# Altium project Dust1_MotherBoard_STM32WBA5MMG.PrjPcb
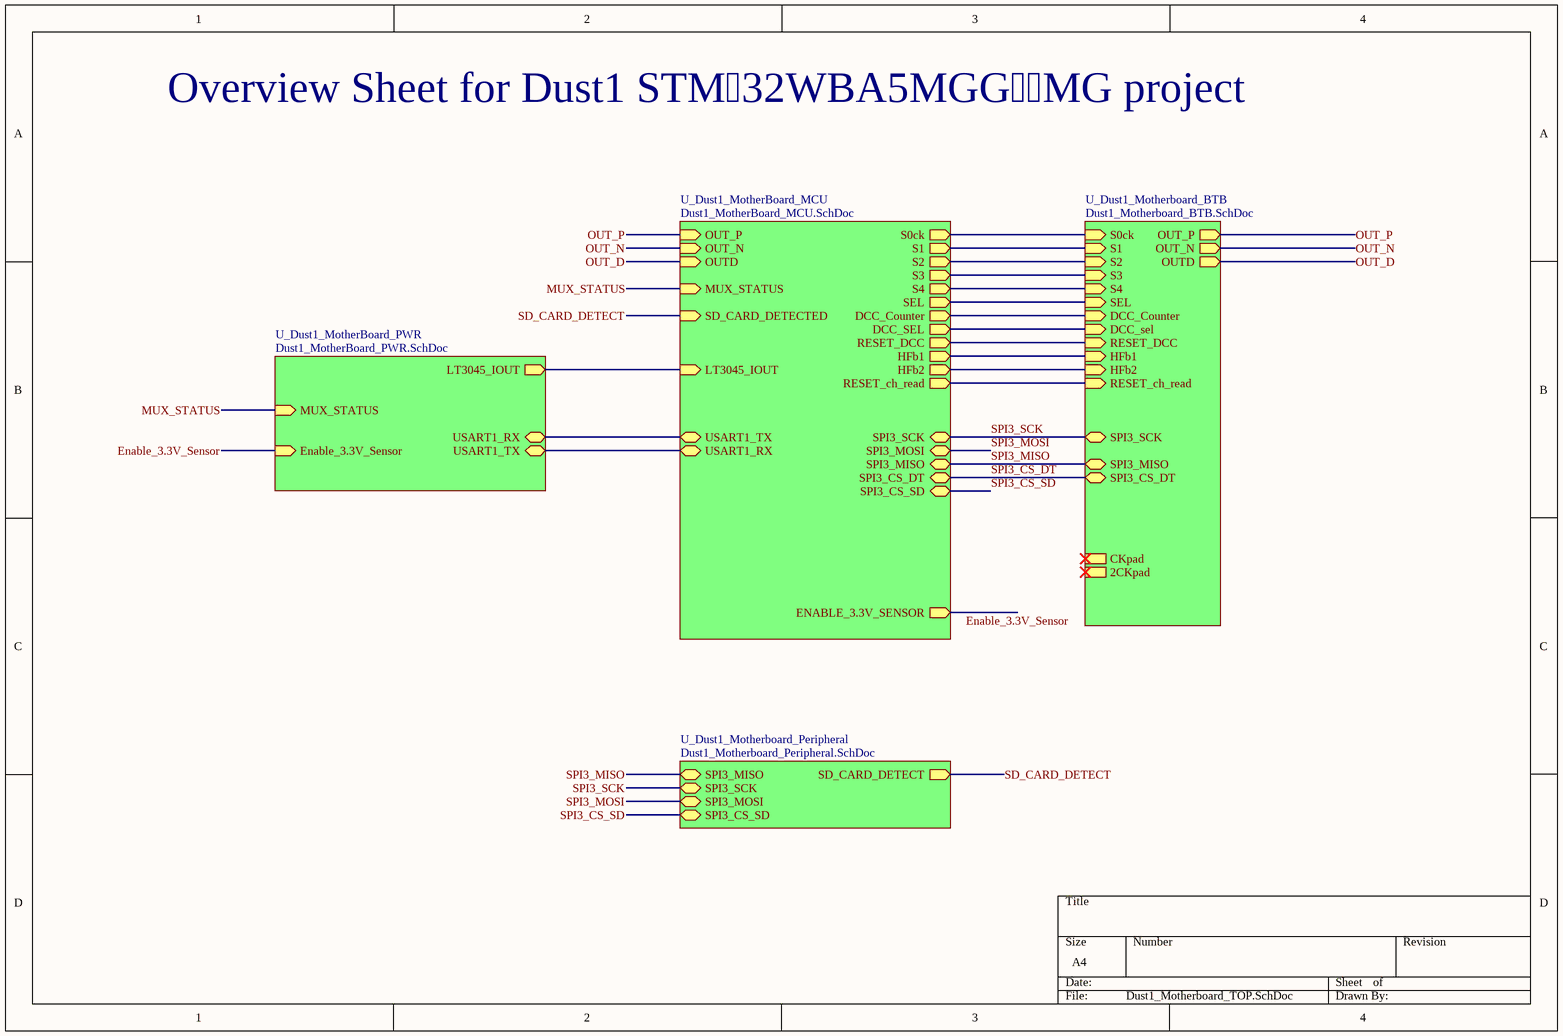
[diagram p0: Dust1_Motherboard_TOP.SchDoc]
5 sheets, 68 parts. Net scope: hierarchical (ports join the sheet entries above them; power ports are global).
Board file: Dust1_Motherboard_STM32WBA5MMG.PcbDoc
Sheets:
  Dust1_Motherboard_TOP.SchDoc
    U_Dust1_Motherboard_BTB = Dust1_Motherboard_BTB.SchDoc
    U_Dust1_MotherBoard_MCU = Dust1_MotherBoard_MCU.SchDoc
    U_Dust1_Motherboard_Peripheral = Dust1_Motherboard_Peripheral.SchDoc
    U_Dust1_MotherBoard_PWR = Dust1_MotherBoard_PWR.SchDoc

## Sheet Dust1_Motherboard_TOP.SchDoc
size A4; SheetNumber: 1; SheetTotal: 5

### Sub-sheets
U_Dust1_Motherboard_BTB = Dust1_Motherboard_BTB.SchDoc: OUT_P (out), OUT_N (out), DCC_Counter (in), OUTD (out), CKpad, 2CKpad, DCC_sel (in), RESET_DCC (in), S4 (in), S3 (in), S2 (in), S1 (in), SEL (in), SPI3_SCK (bidir), SPI3_MISO (bidir), SPI3_CS_DT (bidir), RESET_ch_read (in), HFb1 (in), HFb2 (in), S0ck (in)
U_Dust1_MotherBoard_MCU = Dust1_MotherBoard_MCU.SchDoc: SPI3_CS_DT (bidir), SPI3_MOSI (bidir), SPI3_MISO (bidir), SPI3_SCK (bidir), SPI3_CS_SD (bidir), USART1_TX (bidir), LT3045_IOUT (in), S0ck (out), S1 (out), S2 (out), S3 (out), S4 (out), SEL (out), DCC_Counter (out), DCC_SEL (out), OUTD (in), RESET_DCC (out), HFb1 (out), HFb2 (out), USART1_RX (bidir), ENABLE_3.3V_SENSOR (out), SD_CARD_DETECTED (in), RESET_ch_read (out), OUT_P (in), OUT_N (in), MUX_STATUS (in)
U_Dust1_Motherboard_Peripheral = Dust1_Motherboard_Peripheral.SchDoc: SPI3_MISO (bidir), SPI3_SCK (bidir), SPI3_MOSI (bidir), SPI3_CS_SD (bidir), SD_CARD_DETECT (out)
U_Dust1_MotherBoard_PWR = Dust1_MotherBoard_PWR.SchDoc: USART1_RX (bidir), USART1_TX (bidir), MUX_STATUS (in), Enable_3.3V_Sensor (in), LT3045_IOUT (out)

### Nets
DCC_Counter: sheet U_Dust1_Motherboard_BTB/DCC_Counter, sheet U_Dust1_MotherBoard_MCU/DCC_Counter
DCC_SEL: sheet U_Dust1_Motherboard_BTB/DCC_sel, sheet U_Dust1_MotherBoard_MCU/DCC_SEL
Enable_3.3V_Sensor: sheet U_Dust1_MotherBoard_MCU/ENABLE_3.3V_SENSOR, sheet U_Dust1_MotherBoard_PWR/Enable_3.3V_Sensor
HFb1: sheet U_Dust1_Motherboard_BTB/HFb1, sheet U_Dust1_MotherBoard_MCU/HFb1
HFb2: sheet U_Dust1_Motherboard_BTB/HFb2, sheet U_Dust1_MotherBoard_MCU/HFb2
LT3045_IOUT: sheet U_Dust1_MotherBoard_MCU/LT3045_IOUT, sheet U_Dust1_MotherBoard_PWR/LT3045_IOUT
MUX_STATUS: sheet U_Dust1_MotherBoard_MCU/MUX_STATUS, sheet U_Dust1_MotherBoard_PWR/MUX_STATUS
OUT_D: sheet U_Dust1_Motherboard_BTB/OUTD, sheet U_Dust1_MotherBoard_MCU/OUTD
OUT_N: sheet U_Dust1_Motherboard_BTB/OUT_N, sheet U_Dust1_MotherBoard_MCU/OUT_N
OUT_P: sheet U_Dust1_Motherboard_BTB/OUT_P, sheet U_Dust1_MotherBoard_MCU/OUT_P
RESET_ch_read: sheet U_Dust1_Motherboard_BTB/RESET_ch_read, sheet U_Dust1_MotherBoard_MCU/RESET_ch_read
RESET_DCC: sheet U_Dust1_Motherboard_BTB/RESET_DCC, sheet U_Dust1_MotherBoard_MCU/RESET_DCC
S0ck: sheet U_Dust1_Motherboard_BTB/S0ck, sheet U_Dust1_MotherBoard_MCU/S0ck
S1: sheet U_Dust1_Motherboard_BTB/S1, sheet U_Dust1_MotherBoard_MCU/S1
S2: sheet U_Dust1_Motherboard_BTB/S2, sheet U_Dust1_MotherBoard_MCU/S2
S3: sheet U_Dust1_Motherboard_BTB/S3, sheet U_Dust1_MotherBoard_MCU/S3
S4: sheet U_Dust1_Motherboard_BTB/S4, sheet U_Dust1_MotherBoard_MCU/S4
SD_CARD_DETECT: sheet U_Dust1_MotherBoard_MCU/SD_CARD_DETECTED, sheet U_Dust1_Motherboard_Peripheral/SD_CARD_DETECT
SEL: sheet U_Dust1_Motherboard_BTB/SEL, sheet U_Dust1_MotherBoard_MCU/SEL
SPI3_CS_DT: sheet U_Dust1_Motherboard_BTB/SPI3_CS_DT, sheet U_Dust1_MotherBoard_MCU/SPI3_CS_DT
SPI3_CS_SD: sheet U_Dust1_MotherBoard_MCU/SPI3_CS_SD, sheet U_Dust1_Motherboard_Peripheral/SPI3_CS_SD
SPI3_MISO: sheet U_Dust1_Motherboard_BTB/SPI3_MISO, sheet U_Dust1_MotherBoard_MCU/SPI3_MISO, sheet U_Dust1_Motherboard_Peripheral/SPI3_MISO
SPI3_MOSI: sheet U_Dust1_MotherBoard_MCU/SPI3_MOSI, sheet U_Dust1_Motherboard_Peripheral/SPI3_MOSI
SPI3_SCK: sheet U_Dust1_Motherboard_BTB/SPI3_SCK, sheet U_Dust1_MotherBoard_MCU/SPI3_SCK, sheet U_Dust1_Motherboard_Peripheral/SPI3_SCK
NetU4_17: sheet U_Dust1_MotherBoard_MCU/USART1_TX, sheet U_Dust1_MotherBoard_PWR/USART1_RX
NetU4_18: sheet U_Dust1_MotherBoard_MCU/USART1_RX, sheet U_Dust1_MotherBoard_PWR/USART1_TX

### Notes on the sheet
- Overview Sheet for Dust1 STM32WBA5MGGMG project

## Sheet Dust1_Motherboard_BTB.SchDoc
size A4; SheetNumber: 4; SheetTotal: 5
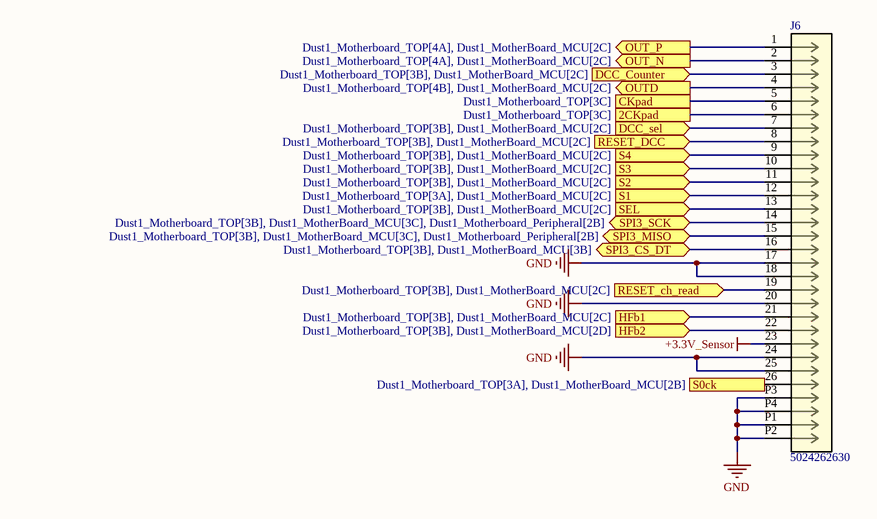
[diagram p1: Dust1_Motherboard_BTB.SchDoc]

### Parts
J6  5024262630  [CON_5024262630_MOL]

### Ports
2CKpad (see Dust1_Motherboard_TOP[3C]), CKpad (see Dust1_Motherboard_TOP[3C]), DCC_Counter (in, see Dust1_Motherboard_TOP[3B], Dust1_MotherBoard_MCU[2C]), DCC_sel (in, see Dust1_Motherboard_TOP[3B], Dust1_MotherBoard_MCU[2C]), HFb1 (in, see Dust1_Motherboard_TOP[3B], Dust1_MotherBoard_MCU[2C]), HFb2 (in, see Dust1_Motherboard_TOP[3B], Dust1_MotherBoard_MCU[2D]), OUT_N (out, see Dust1_Motherboard_TOP[4A], Dust1_MotherBoard_MCU[2C]), OUT_P (out, see Dust1_Motherboard_TOP[4A], Dust1_MotherBoard_MCU[2C]), OUTD (out, see Dust1_Motherboard_TOP[4B], Dust1_MotherBoard_MCU[2C]), RESET_ch_read (in, see Dust1_Motherboard_TOP[3B], Dust1_MotherBoard_MCU[2C]), RESET_DCC (in, see Dust1_Motherboard_TOP[3B], Dust1_MotherBoard_MCU[2C]), S0ck (in, see Dust1_Motherboard_TOP[3A], Dust1_MotherBoard_MCU[2B]), S1 (in, see Dust1_Motherboard_TOP[3A], Dust1_MotherBoard_MCU[2C]), S2 (in, see Dust1_Motherboard_TOP[3B], Dust1_MotherBoard_MCU[2C]), S3 (in, see Dust1_Motherboard_TOP[3B], Dust1_MotherBoard_MCU[2C]), S4 (in, see Dust1_Motherboard_TOP[3B], Dust1_MotherBoard_MCU[2C]), SEL (in, see Dust1_Motherboard_TOP[3B], Dust1_MotherBoard_MCU[2C]), SPI3_CS_DT (bidir, see Dust1_Motherboard_TOP[3B], Dust1_MotherBoard_MCU[3B]), SPI3_MISO (bidir, see Dust1_Motherboard_TOP[3B], Dust1_MotherBoard_MCU[3C], Dust1_Motherboard_Peripheral[2B]), SPI3_SCK (bidir, see Dust1_Motherboard_TOP[3B], Dust1_MotherBoard_MCU[3C], Dust1_Motherboard_Peripheral[2B])

### Nets
+3.3V_Sensor: J6.23
GND: J6.17 J6.18 J6.20 J6.24 J6.25 J6.P1 J6.P2 J6.P3 J6.P4
DCC_Counter: J6.3 ; port DCC_Counter
DCC_SEL: J6.7 ; port DCC_sel
HFb1: J6.21 ; port HFb1
HFb2: J6.22 ; port HFb2
OUT_D: J6.4 ; port OUTD
OUT_N: J6.2 ; port OUT_N
OUT_P: J6.1 ; port OUT_P
RESET_ch_read: J6.19 ; port RESET_ch_read
RESET_DCC: J6.8 ; port RESET_DCC
S0ck: J6.26 ; port S0ck
S1: J6.12 ; port S1
S2: J6.11 ; port S2
S3: J6.10 ; port S3
S4: J6.9 ; port S4
SEL: J6.13 ; port SEL
SPI3_CS_DT: J6.16 ; port SPI3_CS_DT
SPI3_MISO: J6.15 ; port SPI3_MISO
SPI3_SCK: J6.14 ; port SPI3_SCK
NetJ6_5: J6.5 ; port CKpad
NetJ6_6: J6.6 ; port 2CKpad

### Library data of the parts
J6 = CMP-125-000000-4: SlimStack Board-to-Board Receptacle, 0.40mm Pitch, Surface Mount, Dual Row, Vertical, 1.00mm Stacking Height, with Solder Tabs, with Vacuum Tape, 26 Circuits; Manufacturer_Name: Molex Connector Corporation; RefDes: RefDes; Copyright: Copyright (C) 2025 Ultra Librarian. All rights reserved.; Manufacturer_Part_Number: 5024262630; Design Item ID: 5024262630; Source: 5024262630.SchLib; Type: Type

## Sheet Dust1_MotherBoard_MCU.SchDoc
size A4; SheetNumber: 2; SheetTotal: 5
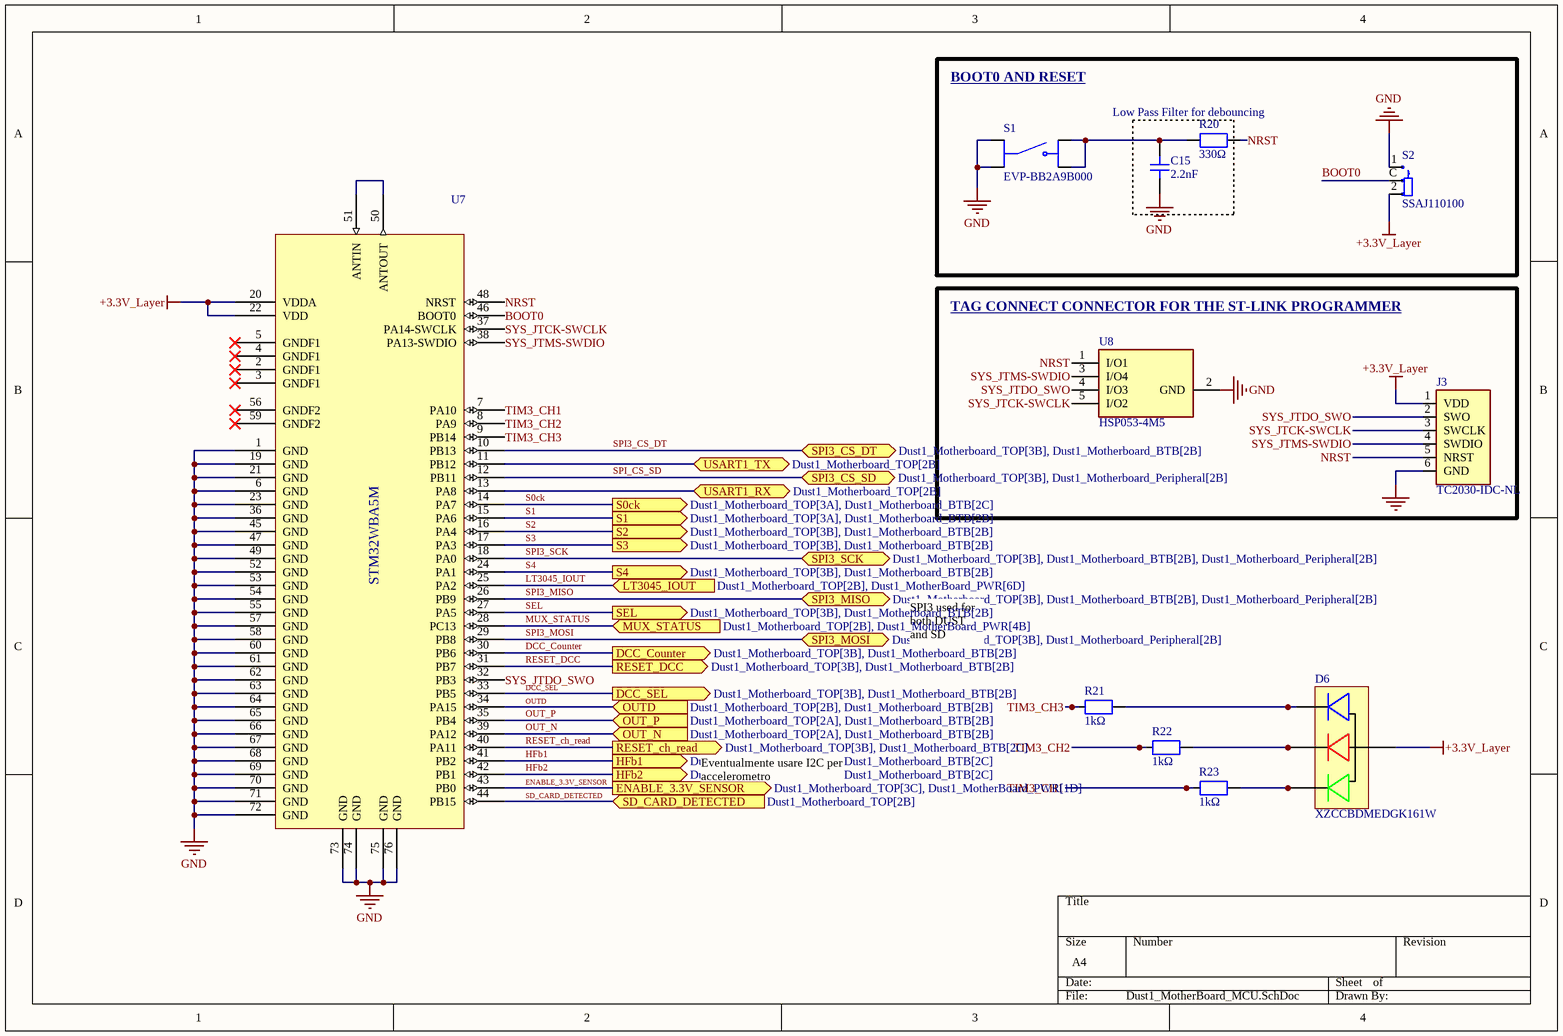
[diagram p2: Dust1_MotherBoard_MCU.SchDoc]

### Parts
C15  2.2nF  [CAP_0402]
D6  XZCCBDMEDGK161W  [PCBComponent_1]
J3  TC2030-IDC-NL  [TAG_TC2030-IDC-NL]
R20  330Ω  [RES_0402]
R21  1kΩ  [RES_0402]
R22  1kΩ  [RES_0402]
R23  1kΩ  [RES_0402]
S1  EVP-BB2A9B000  [SW_EVP-BB2A9B000]
S2  SSAJ110100  [SW_SSAJ110100]
U7  STM32WBA5MMG  [LGA76_stm32wba5mmg_C50P9X9_800X1250X137]  (value not drawn)
U8  HSP053-4M5  [HSP0534M5]

### Blocks framed on the sheet
BOOT0 AND RESET: C15 R20 S1 S2
TAG CONNECT CONNECTOR FOR THE ST-LINK PROGRAMMER: J3 U8

### Ports
DCC_Counter (out, see Dust1_Motherboard_TOP[3B], Dust1_Motherboard_BTB[2B]), DCC_SEL (out, see Dust1_Motherboard_TOP[3B], Dust1_Motherboard_BTB[2B]), ENABLE_3.3V_SENSOR (out, see Dust1_Motherboard_TOP[3C], Dust1_MotherBoard_PWR[1D]), HFb1 (out, see Dust1_Motherboard_TOP[3B], Dust1_Motherboard_BTB[2C]), HFb2 (out, see Dust1_Motherboard_TOP[3B], Dust1_Motherboard_BTB[2C]), LT3045_IOUT (in, see Dust1_Motherboard_TOP[2B], Dust1_MotherBoard_PWR[6D]), MUX_STATUS (in, see Dust1_Motherboard_TOP[2B], Dust1_MotherBoard_PWR[4B]), OUT_N (in, see Dust1_Motherboard_TOP[2A], Dust1_Motherboard_BTB[2B]), OUT_P (in, see Dust1_Motherboard_TOP[2A], Dust1_Motherboard_BTB[2B]), OUTD (in, see Dust1_Motherboard_TOP[2B], Dust1_Motherboard_BTB[2B]), RESET_ch_read (out, see Dust1_Motherboard_TOP[3B], Dust1_Motherboard_BTB[2C]), RESET_DCC (out, see Dust1_Motherboard_TOP[3B], Dust1_Motherboard_BTB[2B]), S0ck (out, see Dust1_Motherboard_TOP[3A], Dust1_Motherboard_BTB[2C]), S1 (out, see Dust1_Motherboard_TOP[3A], Dust1_Motherboard_BTB[2B]), S2 (out, see Dust1_Motherboard_TOP[3B], Dust1_Motherboard_BTB[2B]), S3 (out, see Dust1_Motherboard_TOP[3B], Dust1_Motherboard_BTB[2B]), S4 (out, see Dust1_Motherboard_TOP[3B], Dust1_Motherboard_BTB[2B]), SD_CARD_DETECTED (in, see Dust1_Motherboard_TOP[2B]), SEL (out, see Dust1_Motherboard_TOP[3B], Dust1_Motherboard_BTB[2B]), SPI3_CS_DT (bidir, see Dust1_Motherboard_TOP[3B], Dust1_Motherboard_BTB[2B]), SPI3_CS_SD (bidir, see Dust1_Motherboard_TOP[3B], Dust1_Motherboard_Peripheral[2B]), SPI3_MISO (bidir, see Dust1_Motherboard_TOP[3B], Dust1_Motherboard_BTB[2B], Dust1_Motherboard_Peripheral[2B]), SPI3_MOSI (bidir, see Dust1_Motherboard_TOP[3B], Dust1_Motherboard_Peripheral[2B]), SPI3_SCK (bidir, see Dust1_Motherboard_TOP[3B], Dust1_Motherboard_BTB[2B], Dust1_Motherboard_Peripheral[2B]), USART1_RX (bidir, see Dust1_Motherboard_TOP[2B]), USART1_TX (bidir, see Dust1_Motherboard_TOP[2B])

### Nets
+3.3V_Layer: D6.2 J3.1(VDD) S2.2 U7.20(VDDA) U7.22(VDD)
GND: C15.1 J3.6(GND) S1.A1 S1.A2 S2.1 U7.1(GND) U7.6(GND) U7.19(GND) U7.21(GND) U7.23(GND) U7.36(GND) U7.45(GND) U7.47(GND) U7.49(GND) U7.52(GND) U7.53(GND) U7.54(GND) U7.55(GND) U7.57(GND) U7.58(GND) U7.60(GND) U7.61(GND) U7.62(GND) U7.63(GND) U7.64(GND) U7.65(GND) U7.66(GND) U7.67(GND) U7.68(GND) U7.69(GND) U7.70(GND) U7.71(GND) U7.72(GND) U7.73(GND) U7.74(GND) U7.75(GND) U7.76(GND) U8.2(GND)
BOOT0: S2.C U7.46(BOOT0)
DCC_Counter: U7.30(PB6) ; port DCC_Counter
DCC_SEL: U7.33(PB5) ; port DCC_SEL
Enable_3.3V_Sensor: U7.43(PB0) ; port ENABLE_3.3V_SENSOR
HFb1: U7.41(PB2) ; port HFb1
HFb2: U7.42(PB1) ; port HFb2
LT3045_IOUT: U7.25(PA2) ; port LT3045_IOUT
MUX_STATUS: U7.28(PC13) ; port MUX_STATUS
NRST: J3.5(NRST) R20.2 U7.48(NRST) U8.1(I/O1)
OUT_N: U7.39(PA12) ; port OUT_N
OUT_P: U7.35(PB4) ; port OUT_P
OUTD: U7.34(PA15) ; port OUTD  [project net OUT_D]
RESET_ch_read: U7.40(PA11) ; port RESET_ch_read
RESET_DCC: U7.31(PB7) ; port RESET_DCC
S0ck: U7.14(PA7) ; port S0ck
S1: U7.15(PA6) ; port S1
S2: U7.16(PA4) ; port S2
S3: U7.17(PA3) ; port S3
S4: U7.24(PA1) ; port S4
SD_CARD_DETECTED: U7.44(PB15) ; port SD_CARD_DETECTED  [project net SD_CARD_DETECT]
SEL: U7.27(PA5) ; port SEL
SPI3_CS_DT: U7.10(PB13) ; port SPI3_CS_DT
SPI3_MISO: U7.26(PB9) ; port SPI3_MISO
SPI3_MOSI: U7.29(PB8) ; port SPI3_MOSI
SPI3_SCK: U7.18(PA0) ; port SPI3_SCK
SPI_CS_SD: U7.12(PB11) ; port SPI3_CS_SD  [project net SPI3_CS_SD]
SYS_JTCK-SWCLK: J3.3(SWCLK) U7.37(PA14-SWCLK) U8.5(I/O2)
SYS_JTDO_SWO: J3.2(SWO) U7.32(PB3) U8.4(I/O3)
SYS_JTMS-SWDIO: J3.4(SWDIO) U7.38(PA13-SWDIO) U8.3(I/O4)
TIM3_CH1: R23.1 U7.7(PA10)
TIM3_CH2: R22.1 U7.8(PA9)
TIM3_CH3: R21.1 U7.9(PB14)
NetC15_2: C15.2 R20.1 S1.B1 S1.B2
NetD6_1: D6.1 R21.2
NetD6_3: D6.3 R22.2
NetD6_4: D6.4 R23.2
NetU4_17: U7.11(PB12) ; port USART1_TX
NetU4_18: U7.13(PA8) ; port USART1_RX
NetU7_50: U7.50(ANTOUT) U7.51(ANTIN)

Not connected (* = marked no-connect by the designer): U7 2(GNDF1)* 3(GNDF1)* 4(GNDF1)* 5(GNDF1)* 56(GNDF2)* 59(GNDF2)*

### Notes on the sheet
- (near R20) Low Pass Filter for debouncing
- SPI3 used for both DUST and SD
- Eventualmente usare I2C per accelerometro
- (in symbol CMP-00014-5) STM32WBA5M

### Library data of the parts
C15 = CMP-001-00099-2: Generic 0402 Capacitor; Design Item ID: CAP_0402; Source: CAP_0402.SchLib
D6 = CMP-007-00036-1: Source: XZCCBDMEDGK161W.SchLib; Design Item ID: XZCCBDMEDGK161W
J3 = CMP-00019-5: CABLE ADAPTER 6 POS; Component Type: Standard; Design Item ID: TC2030-IDC-NL; Package: None; MP: TC2030-IDC-NL; Value: *; Pin Count: 6; Source: TC2030-IDC-NL.SchLib; Availability: Unavailable; Price: None
R20-R23 = CMP-009-00192-1: Resistor SMD 0402 Generic; Design Item ID: RES_0402; Source: RES_0402.SchLib
S1 = CMP-011-00022-2: Tactile Switch SPST-NO Top Actuated Surface Mount; MF: Panasonic Electronic Components; SnapEDA_Link: https://www.snapeda.com/parts/EVP-BB2A9B000/Panasonic+Electronic+Components/view-part/?ref=snap; Pins: 4; Value: *; Design Item ID: EVP-BB2A9B000; Check_prices: https://www.snapeda.com/parts/EVP-BB2A9B000/Panasonic+Electronic+Components/view-part/?ref=eda; Case/Package: None; MP: EVP-BB2A9B000; Component Type: Standard; Source: EVP-BB2A9B000.SchLib
S2 = CMP-011-00025-3: Slide Switch â€¢ Rating (max.): 10 mA 5 VDC â€¢ Poles: 1 â€¢ Positions: 2 â€¢ Travel : 1.4 mm â€¢ Operating direction: Horizontal; MF: ALPS; Source: SSAJ110100.SchLib; MP: SSAJ110100; Case/Package: None; Availability: In Stock; Value: *; Purchase-URL: https://pricing.snapeda.com/search/part/SSAJ110100/?ref=eda; Component Type: Standard; Design Item ID: SSAJ110100; Check_prices: https://www.snapeda.com/parts/SSAJ110100/ALPS/view-part/?ref=eda; Price: None; Pins: 3; SnapEDA_Link: https://www.snapeda.com/parts/SSAJ110100/ALPS/view-part/?ref=snap
U7 = CMP-00014-5: Bluetooth LE and IEEE 802.15.4 radio module
U8 = CMP-004-00039-6: Clamp Ipp Tvs Diode Surface Mount 5-uQFN (1.3x0.8); Manufacturer_Name: STMicroelectronics; Geometry.Height: 0.4mm; Source: HSP053-4M5.SchLib; Design Item ID: HSP053-4M5; Mouser Price/Stock: https://www.mouser.co.uk/ProductDetail/STMicroelectronics/HSP053-4M5?qs=lYGu3FyN48c0CphNYEE2iw%3D%3D; Mouser Part Number: 511-HSP053-4M5; Datasheet Link: https://www.st.com/resource/en/datasheet/hsp051-4m5.pdf; Manufacturer_Part_Number: HSP053-4M5

## Sheet Dust1_Motherboard_Peripheral.SchDoc
size A4; SheetNumber: 5; SheetTotal: 5
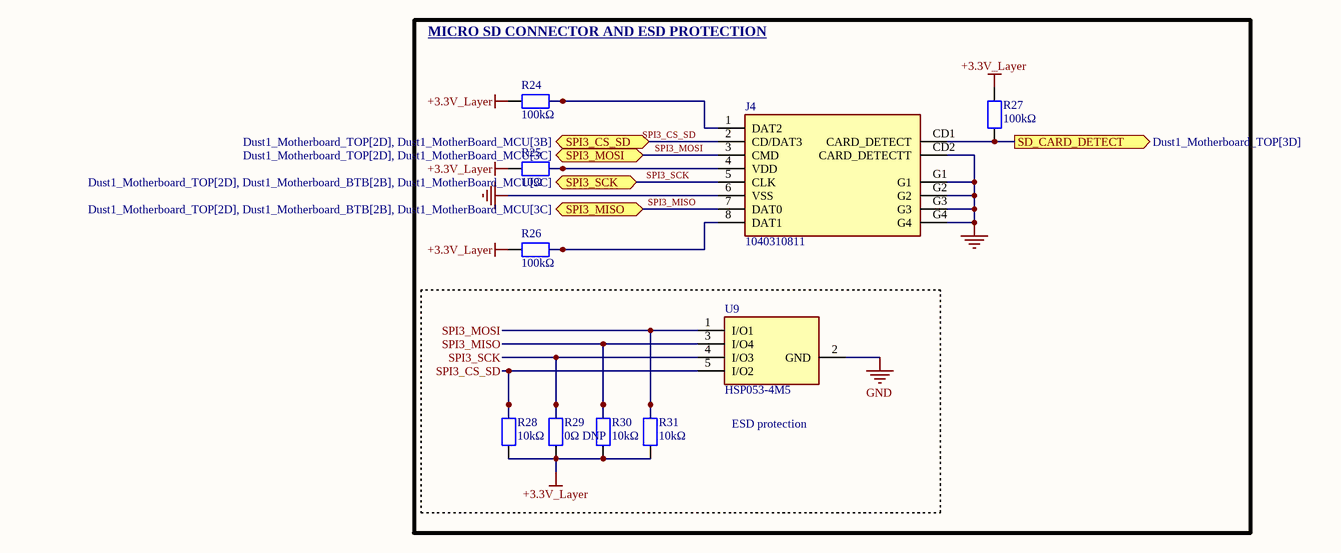
[diagram p3: Dust1_Motherboard_Peripheral.SchDoc]

### Parts
J4  1040310811  [1040310811]
R24  100kΩ  [RES_0402]
R25  10Ω  [RES_0402]
R26  100kΩ  [RES_0402]
R27  100kΩ  [RES_0402]
R28  10kΩ  [RES_0402]
R29  0Ω DNP  [RES_0402]
R30  10kΩ  [RES_0402]
R31  10kΩ  [RES_0402]
U9  HSP053-4M5  [HSP0534M5]

### Blocks framed on the sheet
MICRO SD CONNECTOR AND ESD PROTECTION: J4 R24-R27
ESD protection: R28-R31 U9

### Ports
SD_CARD_DETECT (out, see Dust1_Motherboard_TOP[3D]), SPI3_CS_SD (bidir, see Dust1_Motherboard_TOP[2D], Dust1_MotherBoard_MCU[3B]), SPI3_MISO (bidir, see Dust1_Motherboard_TOP[2D], Dust1_Motherboard_BTB[2B], Dust1_MotherBoard_MCU[3C]), SPI3_MOSI (bidir, see Dust1_Motherboard_TOP[2D], Dust1_MotherBoard_MCU[3C]), SPI3_SCK (bidir, see Dust1_Motherboard_TOP[2D], Dust1_Motherboard_BTB[2B], Dust1_MotherBoard_MCU[3C])

### Nets
+3.3V_Layer: R24.2 R25.2 R26.2 R27.2 R28.1 R29.1 R30.1 R31.1
GND: J4.6(VSS) J4.CD2(CARD_DETECTT) J4.G1 J4.G2 J4.G3 J4.G4 U9.2(GND)
SD_CARD_DETECT: J4.CD1(CARD_DETECT) R27.1 ; port SD_CARD_DETECT
SPI3_CS_SD: J4.2(CD/DAT3) R28.2 U9.5(I/O2) ; port SPI3_CS_SD
SPI3_MISO: J4.7(DAT0) R30.2 U9.3(I/O4) ; port SPI3_MISO
SPI3_MOSI: J4.3(CMD) R31.2 U9.1(I/O1) ; port SPI3_MOSI
SPI3_SCK: J4.5(CLK) R29.2 U9.4(I/O3) ; port SPI3_SCK
NetJ4_1: J4.1(DAT2) R24.1
NetJ4_4: J4.4(VDD) R25.1
NetJ4_8: J4.8(DAT1) R26.1

### Library data of the parts
J4 = CMP-002-00092-2: 1.10mm Pitch microSD Memory Card Connector, Surface Mount, Push-Pull Type, 1.42mm Height, with Detect Switch; Manufacturer_Name: Molex; Geometry.Height: 1.77mm; Manufacturer_Part_Number: 1040310811; Source: 1040310811.SchLib; Mouser Price/Stock: *; Arrow Price/Stock: https://www.arrow.com/en/products/1040310811/molex?utm_currency=USD&region=europe; Mouser Part Number: *; Design Item ID: 1040310811; Datasheet Link: https://www.molex.com/en-us/products/part-detail-pdf/1040310811?display=pdf; Arrow Part Number: 1040310811
R24-R31 = CMP-009-00192-1: Resistor SMD 0402 Generic; Design Item ID: RES_0402; Source: RES_0402.SchLib
U9 = CMP-004-00039-6: as U8 on sheet Dust1_MotherBoard_MCU; Source: HSP053-4M5.SchLib; Design Item ID: HSP053-4M5; Mouser Price/Stock: https://www.mouser.co.uk/ProductDetail/STMicroelectronics/HSP053-4M5?qs=lYGu3FyN48c0CphNYEE2iw%3D%3D; Mouser Part Number: 511-HSP053-4M5; Datasheet Link: https://www.st.com/resource/en/datasheet/hsp051-4m5.pdf; Manufacturer_Part_Number: HSP053-4M5

## Sheet Dust1_MotherBoard_PWR.SchDoc
size A3; SheetNumber: 3; SheetTotal: 5
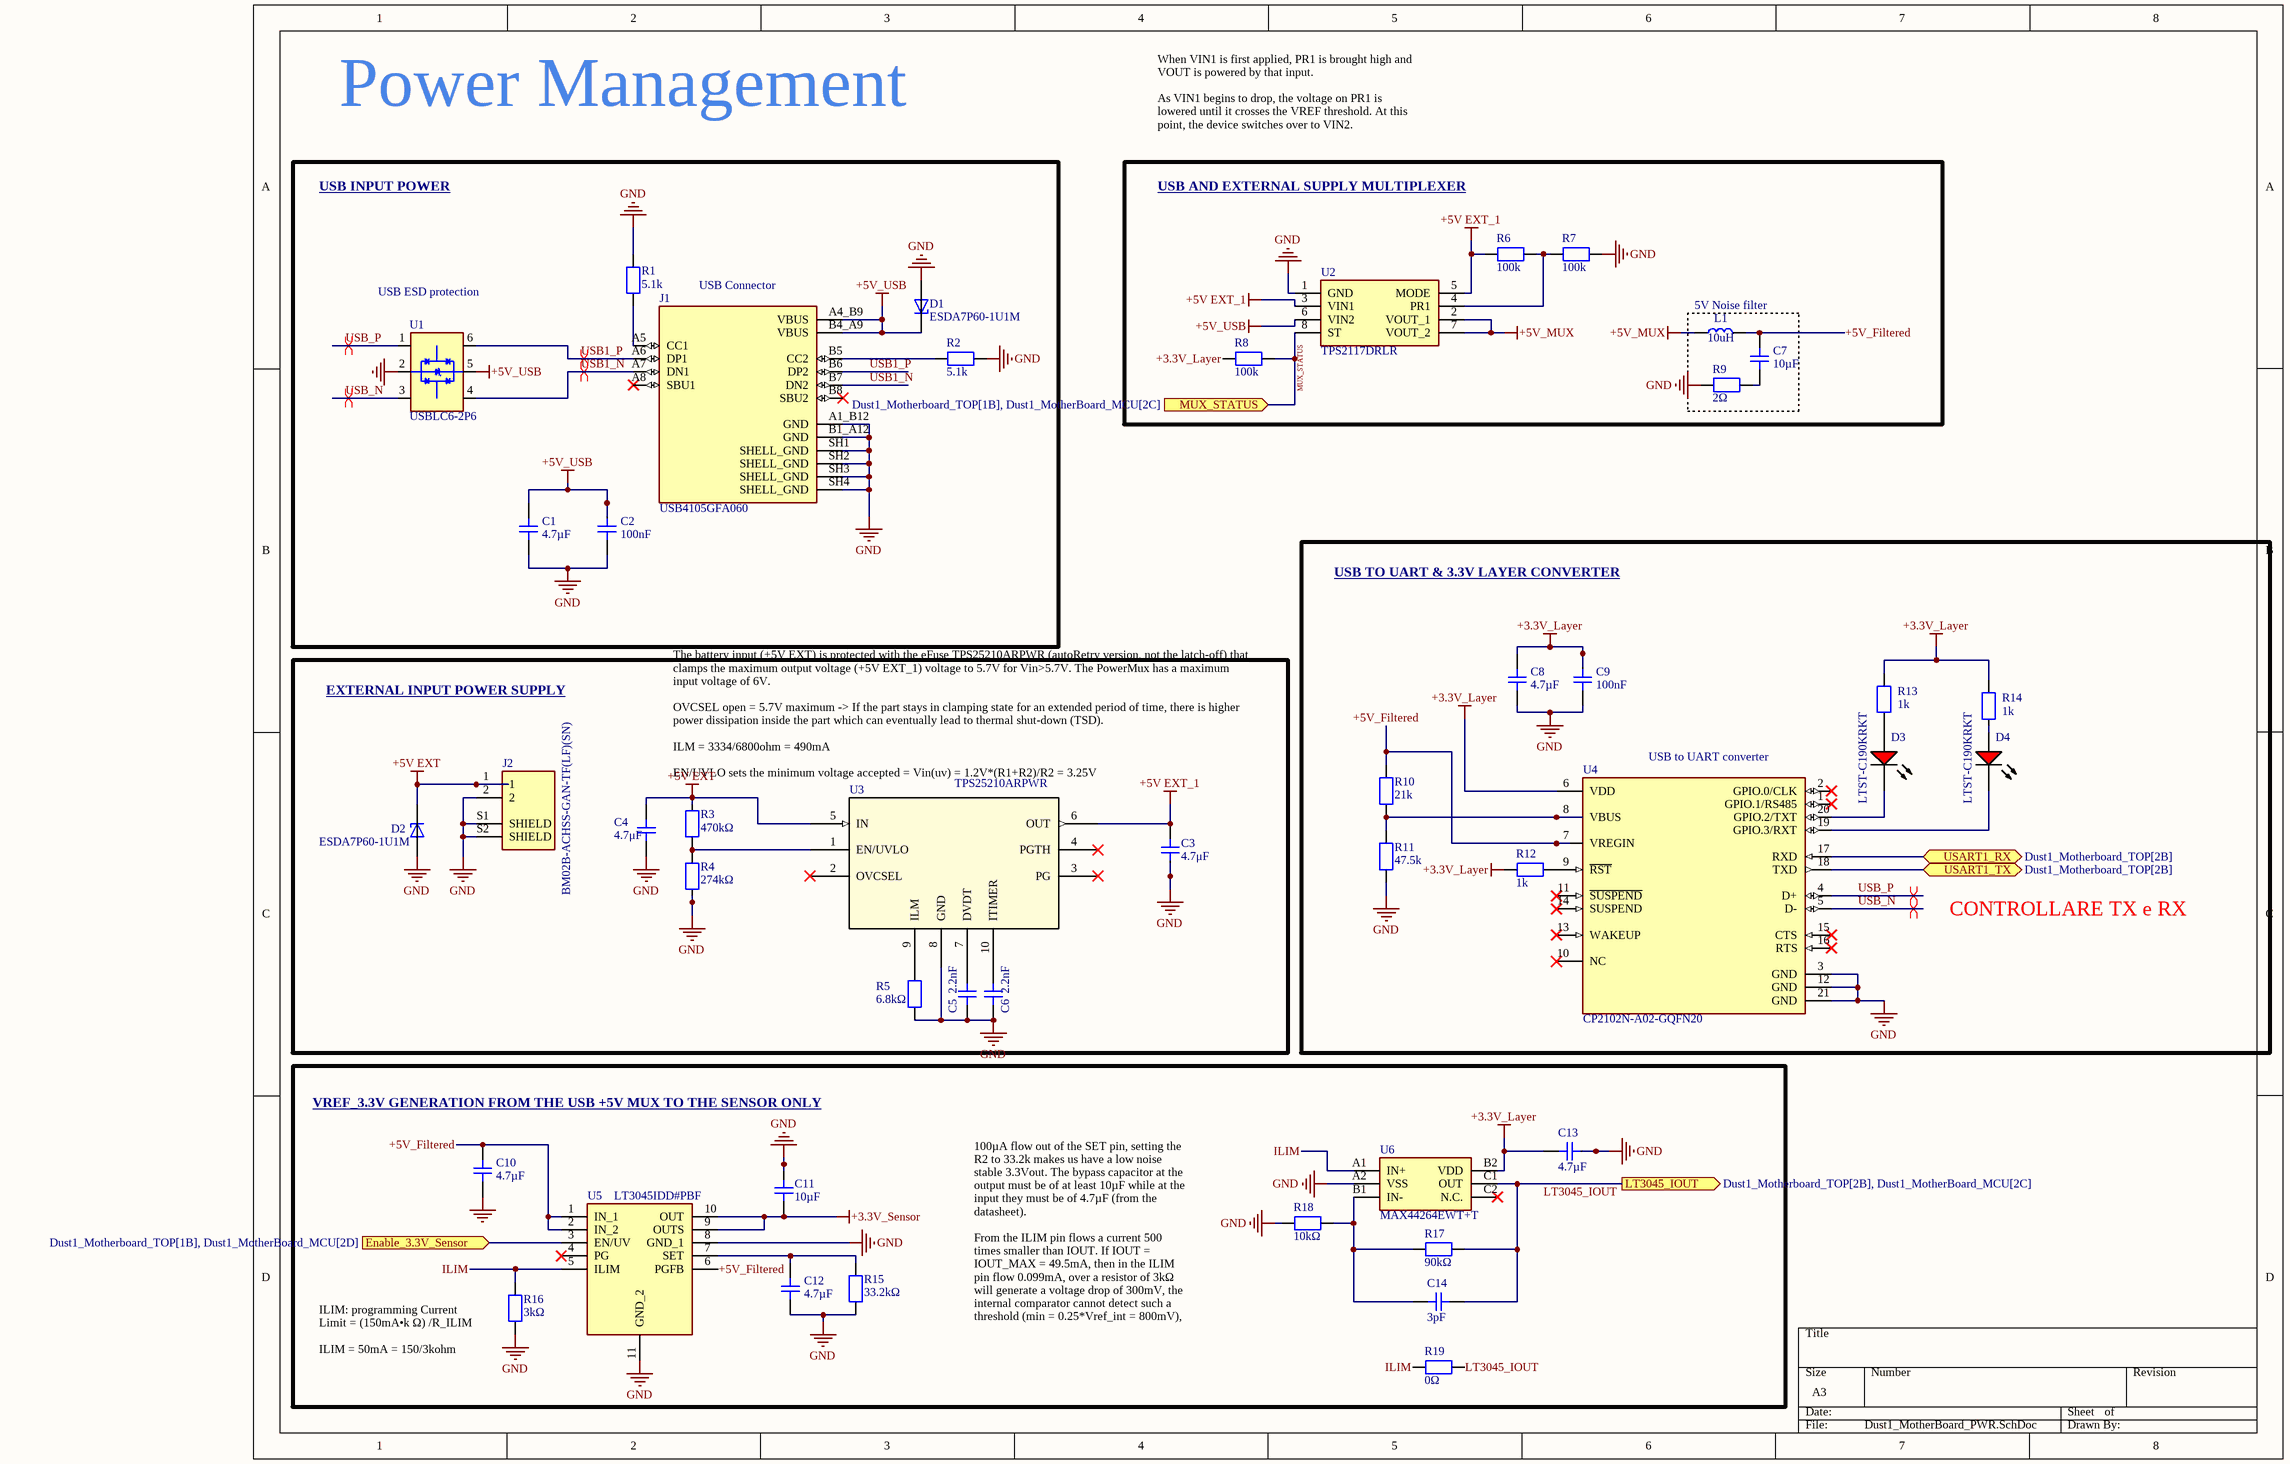
[diagram p4: Dust1_MotherBoard_PWR.SchDoc]

### Parts
C1  4.7µF  [CAP_0603]
C2  100nF  [CAP_0603]
C3  4.7μF  [CAP_0603]
C4  4.7μF  [CAP_0603]
C5  2.2nF  [CAP_0402]
C6  2.2nF  [CAP_0402]
C7  10µF  [CAP_0603]
C8  4.7µF  [CAP_0603]
C9  100nF  [CAP_0603]
C10  4.7µF  [CAP_0603]
C11  10µF  [CAP_0603]
C12  4.7µF  [CAP_0603]
C13  4.7µF  [CAP_0603]
C14  3pF  [CAP_0402]
D1  ESDA7P60-1U1M  [TVS_ESDA7P60-1U1M]
D2  ESDA7P60-1U1M  [TVS_ESDA7P60-1U1M]
D3  LTST-C190KRKT  [LTST-C191KRKT_V]
D4  LTST-C190KRKT  [LTST-C191KRKT_V]
J1  USB4105GFA060  [GCT_USB4105GFA060]
J2  BM02B-ACHSS-GAN-TF(LF)(SN)  [JST_BM02B-ACHSS-GAN-TF(LF)(SN)]
L1  10uH  [IND_0603]
R1  5.1k  [RES_0603]
R2  5.1k  [RES_0603]
R3  470kΩ  [RES_0603]
R4  274kΩ  [RES_0603]
R5  6.8kΩ  [RES_0603]
R6  100k  [RES_0402]
R7  100k  [RES_0402]
R8  100k  [RES_0402]
R9  2Ω  [RES_0603]
R10  21k  [RES_0603]
R11  47.5k  [RES_0603]
R12  1k  [RES_0402]
R13  1k  [RES_0402]
R14  1k  [RES_0402]
R15  33.2kΩ  [RES_0402]
R16  3kΩ  [RES_0402]
R17  90kΩ  [RES_0402]
R18  10kΩ  [RES_0402]
R19  0Ω  [RES_0603]
U1  USBLC6-2P6  [SOT50P160X60-6N]
U2  TPS2117DRLR  [SOTFL50P160X60-8N]
U3  TPS25210ARPWR  [TPS259460ARPWR_TEX]
U4  CP2102N-A02-GQFN20  [FP-CP2102N-A02-GQFN20-MFG]
U5  LT3045IDD#PBF  [SON50P300X300X80-11N-D]
U6  MAX44264EWT+T  [BGA6C40P2X3_91X131X69]

### Blocks framed on the sheet
USB INPUT POWER: C1 C2 D1 J1 R1 R2 U1
USB AND EXTERNAL SUPPLY MULTIPLEXER: R6-R8 U2
5V Noise filter: C7 L1 R9
CONTROLLARE TX e RX: C8 C9 D3 D4 R10-R14 U4
EXTERNAL INPUT POWER SUPPLY: C3-C6 D2 J2 R3-R5 U3
VREF_3.3V GENERATION FROM THE USB +5V MUX TO THE SENSOR ONLY: C10-C14 R15-R19 U5 U6

### Ports
Enable_3.3V_Sensor (in, see Dust1_Motherboard_TOP[1B], Dust1_MotherBoard_MCU[2D]), LT3045_IOUT (out, see Dust1_Motherboard_TOP[2B], Dust1_MotherBoard_MCU[2C]), MUX_STATUS (in, see Dust1_Motherboard_TOP[1B], Dust1_MotherBoard_MCU[2C]), USART1_RX (bidir, see Dust1_Motherboard_TOP[2B]), USART1_TX (bidir, see Dust1_Motherboard_TOP[2B])

### Nets
+3.3V_Layer: C8.2 C9.2 C13.2 R8.2 R12.2 R13.2 R14.2 U4.6(VDD) U6.B2(VDD)
+3.3V_Sensor: C11.1 U5.9(OUTS) U5.10(OUT)
+5V EXT: C4.2 D2.1 J2.1 R3.1 U3.5(IN)
+5V EXT_1: C3.2 R6.1 U2.3(VIN1) U2.5(MODE) U3.6(OUT)
+5V_MUX: L1.1 U2.2(VOUT_1) U2.7(VOUT_2)
+5V_USB: C1.2 C2.2 D1.1 J1.A4_B9(VBUS) J1.B4_A9(VBUS) U1.5(VBUS) U2.6(VIN2)
GND: C1.1 C2.1 C3.1 C4.1 C5.2 C6.2 C8.1 C9.1 C10.1 C11.2 C12.1 C13.1 D1.2 D2.2 J1.A1_B12(GND) J1.B1_A12(GND) J1.SH1(SHELL_GND) J1.SH2(SHELL_GND) J1.SH3(SHELL_GND) J1.SH4(SHELL_GND) J2.2 J2.S1(SHIELD) J2.S2(SHIELD) R1.2 R2.1 R4.2 R5.2 R7.2 R9.1 R11.2 R15.2 R16.2 R18.2 U1.2(GND) U2.1(GND) U3.8(GND) U4.3(GND) U4.12(GND) U4.21(GND) U5.8(GND_1) U5.11(GND_2) U6.A2(VSS)
+5V_Filtered: C7.2 C10.2 L1.2 R10.1 U4.7(VREGIN) U5.1(IN_1) U5.2(IN_2) U5.6(PGFB)
Enable_3.3V_Sensor: U5.3(EN/UV) ; port Enable_3.3V_Sensor
ILIM: R16.1 R19.1 U5.5(ILIM) U6.A1(IN+)
LT3045_IOUT: C14.2 R17.1 R19.2 U6.C1(OUT) ; port LT3045_IOUT
MUX_STATUS: R8.1 U2.8(ST) ; port MUX_STATUS
USB1_N: J1.A7(DN1) J1.B7(DN2) U1.4(I/O2_2)
USB1_P: J1.A6(DP1) J1.B6(DP2) U1.6(I/O1_2)
USB_N: U1.3(I/O2_1) U4.5(D-)
USB_P: U1.1(I/O1_1) U4.4(D+)
NetC5_1: C5.1 U3.7(DVDT)
NetC6_1: C6.1 U3.10(ITIMER)
NetC7_1: C7.1 R9.2
NetC12_2: C12.2 R15.1 U5.7(SET)
NetC14_1: C14.1 R17.2 R18.1 U6.B1(IN-)
NetD3_1: D3.1(A) R13.1
NetD3_2: D3.2(K) U4.20(GPIO.2/TXT)
NetD4_1: D4.1(A) R14.1
NetD4_2: D4.2(K) U4.19(GPIO.3/RXT)
NetJ1_A5: J1.A5(CC1) R1.1
NetJ1_B5: J1.B5(CC2) R2.2
NetR3_2: R3.2 R4.1 U3.1(EN/UVLO)
NetR5_1: R5.1 U3.9(ILM)
NetR6_2: R6.2 R7.1 U2.4(PR1)
NetR10_2: R10.2 R11.1 U4.8(VBUS)
NetR12_1: R12.1 U4.9(~{RST})
NetU4_17: U4.17(RXD) ; port USART1_RX
NetU4_18: U4.18(TXD) ; port USART1_TX

Not connected (* = marked no-connect by the designer): J1 A8(SBU1)* B8(SBU2)*; U3 2(OVCSEL)* 3(PG)* 4(PGTH)*; U4 1(GPIO.1/RS485)* 2(GPIO.0/CLK)* 10(NC)* 11(~{SUSPEND})* 13(WAKEUP)* 14(SUSPEND)* 15(CTS)* 16(RTS)*; U5 4(PG)*; U6 C2(N.C.)*

### Layout directives
differential pair: USB1_N, USB1_P, USB_N, USB_P

### Notes on the sheet
- Power Management
- When VIN1 is first applied, PR1 is brought high and VOUT is powered by that input.
  As VIN1 begins to drop, the voltage on PR1 is lowered until it crosses the VREF threshold. At this point, the device switches over to VIN2.
- (near U1) USB ESD protection
- (near J1) USB Connector
- USB TO UART & 3.3V LAYER CONVERTER
- (near U4) USB to UART converter
- The battery input (+5V EXT) is protected with the eFuse TPS25210ARPWR (autoRetry version, not the latch-off) that clamps the maximum output voltage (+5V EXT_1) voltage to 5.7V for Vin>5.7V. The PowerMux has a maximum input voltage of 6V.
  OVCSEL open = 5.7V maximum -> If the part stays in clamping state for an extended period of time, there is higher power dissipation inside the part which can eventually lead to thermal shut-down (TSD).
  ILM = 3334/6800ohm = 490mA
  EN/UVLO sets the minimum voltage accepted = Vin(uv) = 1.2V*(R1+R2)/R2 = 3.25V
- (near R16) ILIM: programming Current Limit = (150mA•k Ω) /R_ILIM
  ILIM = 50mA = 150/3kohm
- 100µA flow out of the SET pin, setting the R2 to 33.2k makes us have a low noise stable 3.3Vout. The bypass capacitor at the output must be of at least 10µF while at the input they must be of 4.7µF (from the datasheet).
  From the ILIM pin flows a current 500 times smaller than IOUT. If IOUT = IOUT_MAX = 49.5mA, then in the ILIM pin flow 0.099mA, over a resistor of 3kΩ will generate a voltage drop of 300mV, the internal comparator cannot detect such a threshold (min = 0.25*Vref_int = 800mV), gain x10 needed.

### Library data of the parts
C1-C4 C7-C13 = CMP-001-00100-1: Source: CAP_0603.SchLib; Design Item ID: CAP_0603
C5 C6 C14 = CMP-001-00099-2: Generic 0402 Capacitor; Design Item ID: CAP_0402; Source: CAP_0402.SchLib
D1 D2 = CMP-004-00038-2: MF: {'manufacturer': u'STMicroelectronics'}; Price: None; Value: *; Pins: 2; Availability: Unavailable; Component Type: Standard; MP: ESDA7P60-1U1M; Design Item ID: ESDA7P60-1U1M; Case/Package: None; Source: ESDA7P60-1U1M.SchLib
D3 D4 = CMP-007-00024-2: LED Uni-Color Red, 62.5 mW, 25 mA, -30 to 85 degC, 2-Pin SMD, RoHS, Tape and Reel; Manufacturer: Lite-On; Luminous Intensity: 54mcd; Lens Style: Diffused; Forward Voltage: 2V; Power: 75mW; Viewing Angle: 130degrees; Forward Current: 20mA; Mounting Technology: SM; Manufacturer URL: http://www.us.liteon.com/; Max Operating Temperature: 85°C; Packaging: TapeandReel; Package Description: 2-Pin Surface Mount Device, Body 1.6 x 0.8 mm; Nominal Vf: 2V; Min Operating Temperature: -55°C; Datasheet Version: Rev. F, 05/2013; RoHS Compliant: True; Illumination Colour: Red; Colour: Red; Pins: 2; Package Reference: C191KRKT; Datasheet URL: http://optoelectronics.liteon.com/upload/download/DS-22-99-0151/S_110_LTST-C190KRKT.pdf; Package Quantity: 3000; Case/Package: 0603
J1 = CMP-002-00087-2: USB-C (USB TYPE-C) USB 2.0 Receptacle Connector 24 (16+8 Dummy) Position Surface Mount, Right Angle; Through Hole; MF: Global Connector Technology; Source: USB4105GFA060.SchLib; MP: USB4105GFA060; Component Type: Standard; Check_prices: https://www.snapeda.com/parts/USB4105GFA060/Global+Connector+Technology/view-part/?ref=eda; Value: *; Design Item ID: USB4105GFA060; Case/Package: None; Pins: 16; SnapEDA_Link: https://www.snapeda.com/parts/USB4105GFA060/Global+Connector+Technology/view-part/?ref=snap
J2 = CMP-002-00091-1: Connector Header Surface Mount, Right Angle 2 position 0.047 (1.20mm); MF: JST Sales; Pins: 4; Value: *; SnapEDA_Link: https://www.snapeda.com/parts/BM02B-ACHSS-GAN-TF(LF)(SN)/JST/view-part/?ref=snap; MP: BM02B-ACHSS-GAN-TF(LF)(SN); Design Item ID: BM02B-ACHSS-GAN-TF(LF)(SN); Check_prices: https://www.snapeda.com/parts/BM02B-ACHSS-GAN-TF(LF)(SN)/JST/view-part/?ref=eda; Source: BM02B-ACHSS-GAN-TF(LF)(SN).SchLib; Case/Package: None; Component Type: Standard
L1 = CMP-006-00026-1: Generic 0603 Inductor; Source: IND_0603.SchLib; Design Item ID: IND_0603
R1-R5 R9-R11 R19 = CMP-009-00186-1: Design Item ID: RES_0603; Source: RES_0603.SchLib
R6-R8 R12-R18 = CMP-009-00192-1: Resistor SMD 0402 Generic; Design Item ID: RES_0402; Source: RES_0402.SchLib
U1 = CMP-004-00037-4: 17V Clamp 5A (8/20Âµs) Ipp Tvs Diode Surface Mount SOT-666; MF: STMicroelectronics; Value: *; Component Type: Standard; Pins: 6; Check_prices: https://www.snapeda.com/parts/USBLC6-2P6/STMicroelectronics/view-part/?ref=eda; SnapEDA_Link: https://www.snapeda.com/parts/USBLC6-2P6/STMicroelectronics/view-part/?ref=snap; Source: USBLC6-2P6.SchLib; Design Item ID: USBLC6-2P6; Case/Package: SOT-666 STMicroelectronics; MP: USBLC6-2P6
U2 = CMP-011-00021-5: Power Switch ICs - Power Distribution 1.6-V to 5.5-V, 20-m?, 4-A low IQ power multiplexer with manual and priority switchover 8-SOT-5X3 -40 to 125; Manufacturer_Name: Texas Instruments; Geometry.Height: 0.6mm; Mouser Part Number: 595-TPS2117DRLR; Mouser Price/Stock: https://www.mouser.co.uk/ProductDetail/Texas-Instruments/TPS2117DRLR?qs=HoCaDK9Nz5c%2FKe5lpCPPWQ%3D%3D; Datasheet Link: https://www.ti.com/lit/ds/symlink/tps2117.pdf?ts=1704705133749&ref_url=https%253A%252F%252Fwww.ti.com%252Fproduct%252FTPS2117; Source: TPS2117DRLR.SchLib; Manufacturer_Part_Number: TPS2117DRLR; Design Item ID: TPS2117DRLR
U3 = CMP-122-000000-5: 2.7-V to 5.7-V, 31-mâ„; Manufacturer_Name: Texas Instruments; RefDes: RefDes; Design Item ID: TPS25210ARPWR; Manufacturer_Part_Number: TPS25210ARPWR; Type: Type; Copyright: Copyright (C) 2025 Ultra Librarian. All rights reserved.; Source: TPS25210ARPWR.SchLib
U4 = CMP-08093-000006-1: IC USB TO UART BRIDGE QFN20
U5 = CMP-111-000001-2: Linear Technology LT3045IDD#PBF, LDO Regulator, 500mA Adjustable, 0  15 V, +/-1% 10-Pin, DFN; Manufacturer_Name: Analog Devices; Geometry.Height: 0.8mm; Manufacturer_Part_Number: LT3045IDD#PBF; Source: LT3045IDD#PBF.SchLib; Datasheet Link: https://www.analog.com/media/en/technical-documentation/data-sheets/3045fa.pdf; Arrow Part Number: LT3045IDD#PBF; Mouser Part Number: 584-LT3045IDD#PBF; Arrow Price/Stock: https://www.arrow.com/en/products/lt3045iddpbf/analog-devices?utm_currency=USD&region=nac; Design Item ID: LT3045IDD#PBF; Mouser Price/Stock: https://www.mouser.co.uk/ProductDetail/Analog-Devices/LT3045IDDPBF?qs=oahfZPh6IAL0HQTYgxXgGA%3D%3D
U6 = CMP-014-00013-4: MAXIM INTEGRATED PRODUCTS - MAX44264EWT+T - Operational Amplifier, RRIO, 1 Amplifier, 9 kHz, 2 V/ms, 1.8V to 5.5V, WLP, 6 Pins; Manufacturer_Name: Analog Devices; Geometry.Height: 0.69mm; Arrow Price/Stock: *; Datasheet Link: http://datasheets.maximintegrated.com/en/ds/MAX44264.pdf; Arrow Part Number: *; Mouser Price/Stock: https://www.mouser.co.uk/ProductDetail/Analog-Devices-Maxim-Integrated/MAX44264EWT%2bT?qs=tT6YvvQkxsyLGbMOGQ483A%3D%3D; Mouser Part Number: 700-MAX44264EWT+T; Design Item ID: MAX44264EWT+T; Manufacturer_Part_Number: MAX44264EWT+T; Source: MAX44264EWT+T.SchLib

## Nets that join several sheets
+3.3V_Layer: Dust1_MotherBoard_MCU (5 pins), Dust1_Motherboard_Peripheral (8 pins), Dust1_MotherBoard_PWR (9 pins)
+3.3V_Sensor: Dust1_Motherboard_BTB (J6.23), Dust1_MotherBoard_PWR (C11.1 U5.9 U5.10)
GND: Dust1_Motherboard_BTB (9 pins), Dust1_MotherBoard_MCU (38 pins), Dust1_Motherboard_Peripheral (7 pins), Dust1_MotherBoard_PWR (42 pins)
DCC_Counter: Dust1_Motherboard_BTB (J6.3), Dust1_MotherBoard_MCU (U7.30)
DCC_SEL: Dust1_Motherboard_BTB (J6.7), Dust1_MotherBoard_MCU (U7.33)
Enable_3.3V_Sensor: Dust1_MotherBoard_MCU (U7.43), Dust1_MotherBoard_PWR (U5.3)
HFb1: Dust1_Motherboard_BTB (J6.21), Dust1_MotherBoard_MCU (U7.41)
HFb2: Dust1_Motherboard_BTB (J6.22), Dust1_MotherBoard_MCU (U7.42)
LT3045_IOUT: Dust1_MotherBoard_MCU (U7.25), Dust1_MotherBoard_PWR (C14.2 R17.1 R19.2 U6.C1)
MUX_STATUS: Dust1_MotherBoard_MCU (U7.28), Dust1_MotherBoard_PWR (R8.1 U2.8)
NetU4_17: Dust1_MotherBoard_MCU (U7.11), Dust1_MotherBoard_PWR (U4.17)
NetU4_18: Dust1_MotherBoard_MCU (U7.13), Dust1_MotherBoard_PWR (U4.18)
OUT_D: Dust1_Motherboard_BTB (J6.4), Dust1_MotherBoard_MCU (U7.34)
OUT_N: Dust1_Motherboard_BTB (J6.2), Dust1_MotherBoard_MCU (U7.39)
OUT_P: Dust1_Motherboard_BTB (J6.1), Dust1_MotherBoard_MCU (U7.35)
RESET_ch_read: Dust1_Motherboard_BTB (J6.19), Dust1_MotherBoard_MCU (U7.40)
RESET_DCC: Dust1_Motherboard_BTB (J6.8), Dust1_MotherBoard_MCU (U7.31)
S0ck: Dust1_Motherboard_BTB (J6.26), Dust1_MotherBoard_MCU (U7.14)
S1: Dust1_Motherboard_BTB (J6.12), Dust1_MotherBoard_MCU (U7.15)
S2: Dust1_Motherboard_BTB (J6.11), Dust1_MotherBoard_MCU (U7.16)
S3: Dust1_Motherboard_BTB (J6.10), Dust1_MotherBoard_MCU (U7.17)
S4: Dust1_Motherboard_BTB (J6.9), Dust1_MotherBoard_MCU (U7.24)
SD_CARD_DETECT: Dust1_MotherBoard_MCU (U7.44), Dust1_Motherboard_Peripheral (J4.CD1 R27.1)
SEL: Dust1_Motherboard_BTB (J6.13), Dust1_MotherBoard_MCU (U7.27)
SPI3_CS_DT: Dust1_Motherboard_BTB (J6.16), Dust1_MotherBoard_MCU (U7.10)
SPI3_CS_SD: Dust1_MotherBoard_MCU (U7.12), Dust1_Motherboard_Peripheral (J4.2 R28.2 U9.5)
SPI3_MISO: Dust1_Motherboard_BTB (J6.15), Dust1_MotherBoard_MCU (U7.26), Dust1_Motherboard_Peripheral (J4.7 R30.2 U9.3)
SPI3_MOSI: Dust1_MotherBoard_MCU (U7.29), Dust1_Motherboard_Peripheral (J4.3 R31.2 U9.1)
SPI3_SCK: Dust1_Motherboard_BTB (J6.14), Dust1_MotherBoard_MCU (U7.18), Dust1_Motherboard_Peripheral (J4.5 R29.2 U9.4)

## Assembly variants
Variant of Dust1_MotherBoard_STM32WBA5MMG: not fitted R19 R29